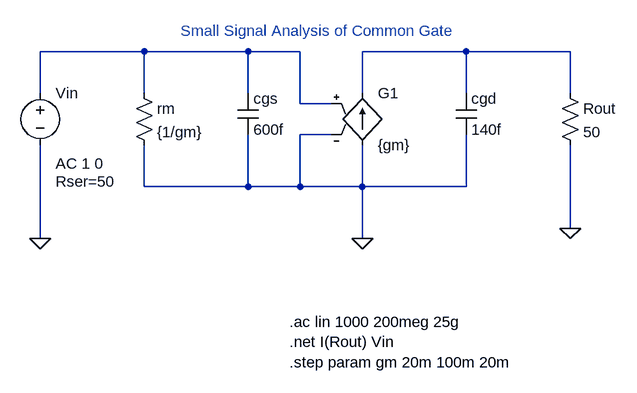
[diagram p0: schematic Small_Signal_Analysis_Common_Gate.asc]
Small_Signal_Analysis_Common_Gate.asc, the LTspice schematic file:
Version 4
SHEET 1 1056 680
WIRE 224 64 64 64
WIRE 384 64 224 64
WIRE 464 64 384 64
WIRE 720 64 560 64
WIRE 880 64 720 64
WIRE 64 128 64 64
WIRE 224 128 224 64
WIRE 384 128 384 64
WIRE 560 128 560 64
WIRE 720 128 720 64
WIRE 880 128 880 64
WIRE 464 144 464 64
WIRE 512 144 464 144
WIRE 512 192 464 192
WIRE 224 272 224 208
WIRE 384 272 384 192
WIRE 384 272 224 272
WIRE 464 272 464 192
WIRE 464 272 384 272
WIRE 560 272 560 208
WIRE 560 272 464 272
WIRE 720 272 720 192
WIRE 720 272 560 272
WIRE 880 336 880 208
WIRE 64 352 64 208
WIRE 560 352 560 272
FLAG 64 352 0
FLAG 560 352 0
FLAG 880 336 0
SYMBOL voltage 64 112 R0
WINDOW 123 24 124 Left 2
WINDOW 39 24 152 Left 2
SYMATTR Value2 AC 1 0
SYMATTR SpiceLine Rser=50
SYMATTR InstName Vin
SYMATTR Value ""
SYMBOL res 208 112 R0
SYMATTR InstName rm
SYMATTR Value {1/gm}
SYMBOL cap 368 128 R0
SYMATTR InstName cgs
SYMATTR Value 600f
SYMBOL g 560 112 R0
SYMATTR InstName G1
SYMATTR Value {gm}
SYMBOL cap 704 128 R0
SYMATTR InstName cgd
SYMATTR Value 140f
SYMBOL res 864 112 R0
SYMATTR InstName Rout
SYMATTR Value 50
TEXT 448 480 Left 2 !.ac lin 1000 200meg 25g\n.net I(Rout) Vin\n.step param gm 20m 100m 20m
TEXT 280 32 Left 2 ;Small Signal Analysis of Common Gate

The netlist it stands for:
* Small_Signal_Analysis_Common_Gate.asc
Vin N001 0 AC 1 0 Rser=50
rm N001 0 {1/gm}
cgs N001 0 600f
G1 0 N002 N001 0 {gm}
cgd N002 0 140f
Rout N002 0 50
.ac lin 1000 200meg 25g
.net I(Rout) Vin
.step param gm 20m 100m 20m
* Small Signal Analysis of Common Gate
.backanno
.end